# Altium schematic sheet current_source.SchDoc: Voltage adjustable current source
size A4
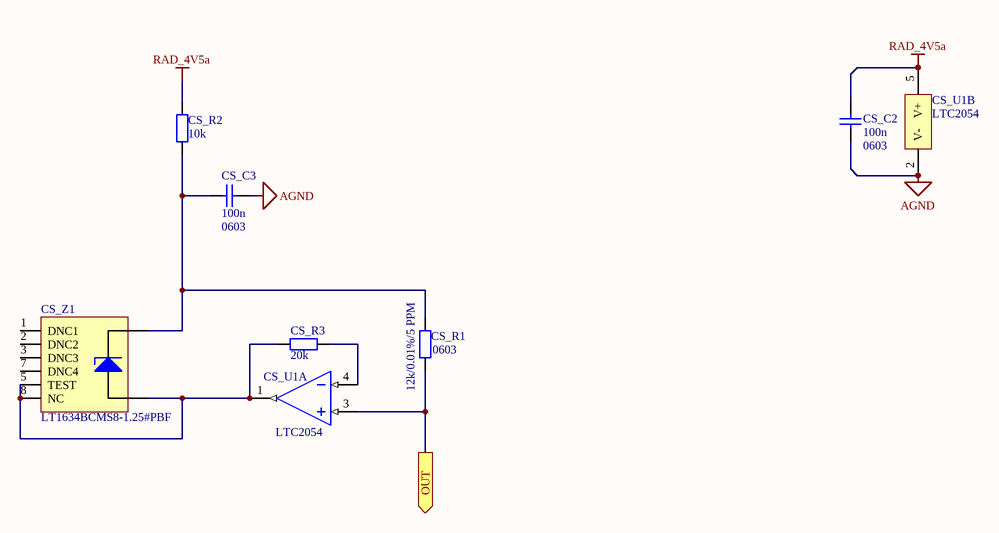
[diagram p0: current_source.SchDoc]

## Parts
CS_C2  value 100n  Package: 0603  [SMD_Capacitor_0603]  (hidden comment: Cap)
CS_C3  value 100n  Package: 0603  [SMD_Capacitor_0603]  (hidden comment: Cap)
CS_R1  Package: 0603  [SMD_Resistor_0603]  (hidden comment: 12k/0.01%/5 PPM)
CS_R2  10k  [SMD_Resistor_0603]
CS_R3  20k  [SMD_Resistor_0603]
CS_U1  LTC2054  [SOT23-5]  (parts A,B of 2)
CS_Z1  1.25V  [MSOP-8]  (value not drawn)

## Ports
OUT (out)

## Nets
AGND: CS_C2.2 CS_C3.1 CS_U1.2(V-)
RAD_4V5a: CS_C2.1 CS_R2.1 CS_U1.5(V+)
OUT: CS_R1.2 CS_U1.3(IN+_A) ; port OUT
NetCS_C3_2: CS_C3.2 CS_R1.1 CS_R2.2 CS_Z1.6(K)
NetCS_R3_1: CS_R3.1 CS_U1.1(OUT_A) CS_Z1.4(A) CS_Z1.5(TEST) CS_Z1.8(NC)
NetCS_R3_2: CS_R3.2 CS_U1.4(IN-_A)

Not connected (* = marked no-connect by the designer): CS_Z1 1(DNC1) 2(DNC2) 3(DNC3) 7(DNC4)

## Notes on the sheet
- Title:
- Sheet:
- of
- Author:
- Model:
- Document Number:
- Checked by:
- Iss-Rev:
- Approved by:
- Date:
- File name:

## Library data of the parts
CS_R1-CS_R3 = Res
  CS_R1: Value: 12k/0.01%/5 PPM
  CS_R2: Value: 10k; Package: 0603
  CS_R3: Value: 20k; Package: 0603
CS_U1 = LTC2054: Single/Dual Micropower  Zero-Drift Operational Amplifi ers; Manufacturer: Linear Technology; Value: LTC2054
CS_Z1 = LT1634BCMS8-1.25#PBF: Micropower Precision  Shunt Voltage Reference; Manufacturer: Linear; Value: 1.25V; ManufacturerPartNumber: LT1634BCMS8-1.25#PBF